# EAGLE design Rxxx (EAGLE 6.6.0)
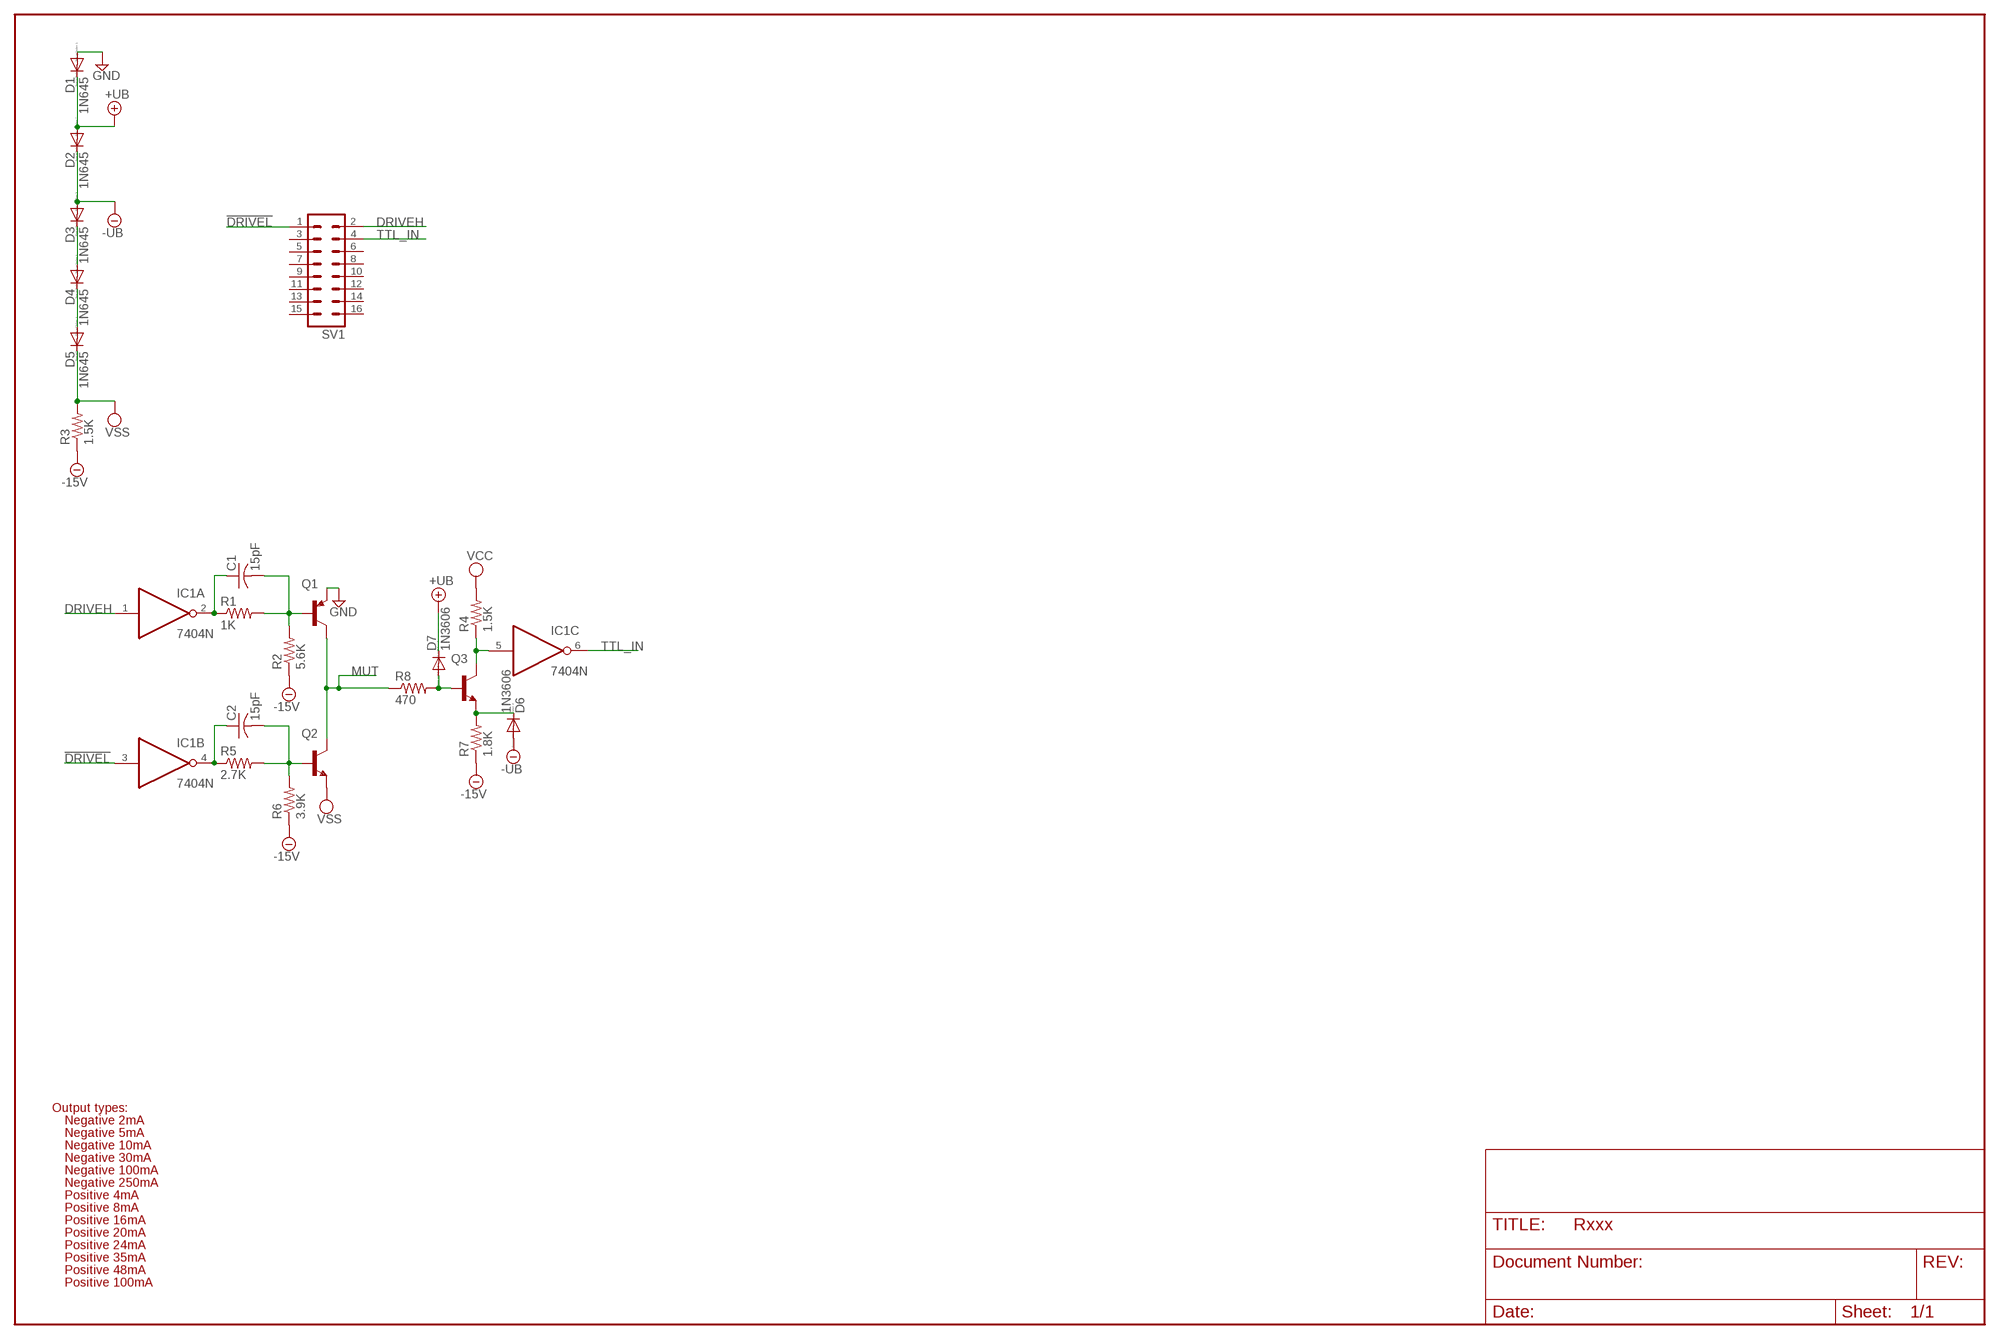
[diagram p0: schematic, sheet 1]

## Parts
C1  15pF  C-US050-025X075  [C050-025X075]
C2  15pF  C-US050-025X075  [C050-025X075]
D1  1N645  DIODE-DO35-10  [DO35-10]
D2  1N645  DIODE-DO35-10  [DO35-10]
D3  1N645  DIODE-DO35-10  [DO35-10]
D4  1N645  DIODE-DO35-10  [DO35-10]
D5  1N645  DIODE-DO35-10  [DO35-10]
D6  1N3606  DIODE-DO35-10  [DO35-10]
D7  1N3606  DIODE-DO35-10  [DO35-10]
IC1  7404N  [DIL14]
Q1  -PNP-TO5  [TO5]
Q2  -NPN-TO5  [TO5]
Q3  -NPN-TO5  [TO5]
R1  1K  R-US_0207/10  [0207/10]
R2  5.6K  R-US_0207/10  [0207/10]
R3  1.5K  R-US_0207/10  [0207/10]
R4  1.5K  R-US_0207/10  [0207/10]
R5  2.7K  R-US_0207/10  [0207/10]
R6  3.9K  R-US_0207/10  [0207/10]
R7  1.8K  R-US_0207/10  [0207/10]
R8  470  R-US_0207/10  [0207/10]
SV1  MA08-2  [MA08-2]

## Nets
!DRIVEL: IC1.3(B:I) SV1.1
+UB [supply]: D1.C D2.A D7.C
-15V [supply]: R2.1 R3.1 R6.1 R7.1
-UB [supply]: D2.C D3.A D6.A
DRIVEH: IC1.1(A:I) SV1.2
GND [supply]: D1.A Q1.1(E)
MUT: Q1.3(C) Q2.3(C) R8.1
N$1: C1.1 IC1.2(A:O) R1.1
N$2: C1.2 Q1.2(B) R1.2 R2.2
N$3: C2.1 IC1.4(B:O) R5.1
N$4: C2.2 Q2.2(B) R5.2 R6.2
N$7: IC1.5(C:I) Q3.3(C) R4.1
N$8: D3.C D4.A
N$9: D4.C D5.A
N$10: D6.C Q3.1(E) R7.2
N$11: D7.A Q3.2(B) R8.2
TTL_IN: IC1.6(C:O) SV1.4
VCC [supply]: R4.2
VSS [supply]: D5.C Q2.1(E) R3.2
Unconnected: IC1.8(D:O) IC1.9(D:I) IC1.10(E:O) IC1.11(E:I) IC1.12(F:O) IC1.13(F:I) SV1.3 SV1.5 SV1.6 SV1.7 SV1.8 SV1.9 SV1.10 SV1.11 SV1.12 SV1.13 SV1.14 SV1.15 SV1.16

## Notes on the sheet
- Output types:
- Negative 2mA
- Negative 5mA
- Negative 10mA
- Negative 30mA
- Negative 100mA
- Negative 250mA
- Positive 4mA
- Positive 8mA
- Positive 16mA
- Positive 20mA
- Positive 24mA
- Positive 35mA
- Positive 48mA
- Positive 100mA

## Power pins joined to a net without a drawn wire
GND: IC1.7(P:GND)
VCC: IC1.14(P:VCC)

## Library data of the parts
C1 C2 = rcl:C-US: CAPACITOR, American symbol
D1-D7 = diode:DIODE-: DIODE
IC1 = 74xx-us:74*04: Hex INVERTER
Q1 = transistor:*-PNP-: PNP Transistror
Q2 Q3 = transistor:*-NPN-: NPN Transistror BF959 corrected 2008.03.06
R1-R8 = rcl:R-US_: RESISTOR, American symbol
SV1 = con-lstb:MA08-2: PIN HEADER; OC_FARNELL: unknown; OC_NEWARK: unknown

## Net classes
1 supply: width 0.813 mm

## Board
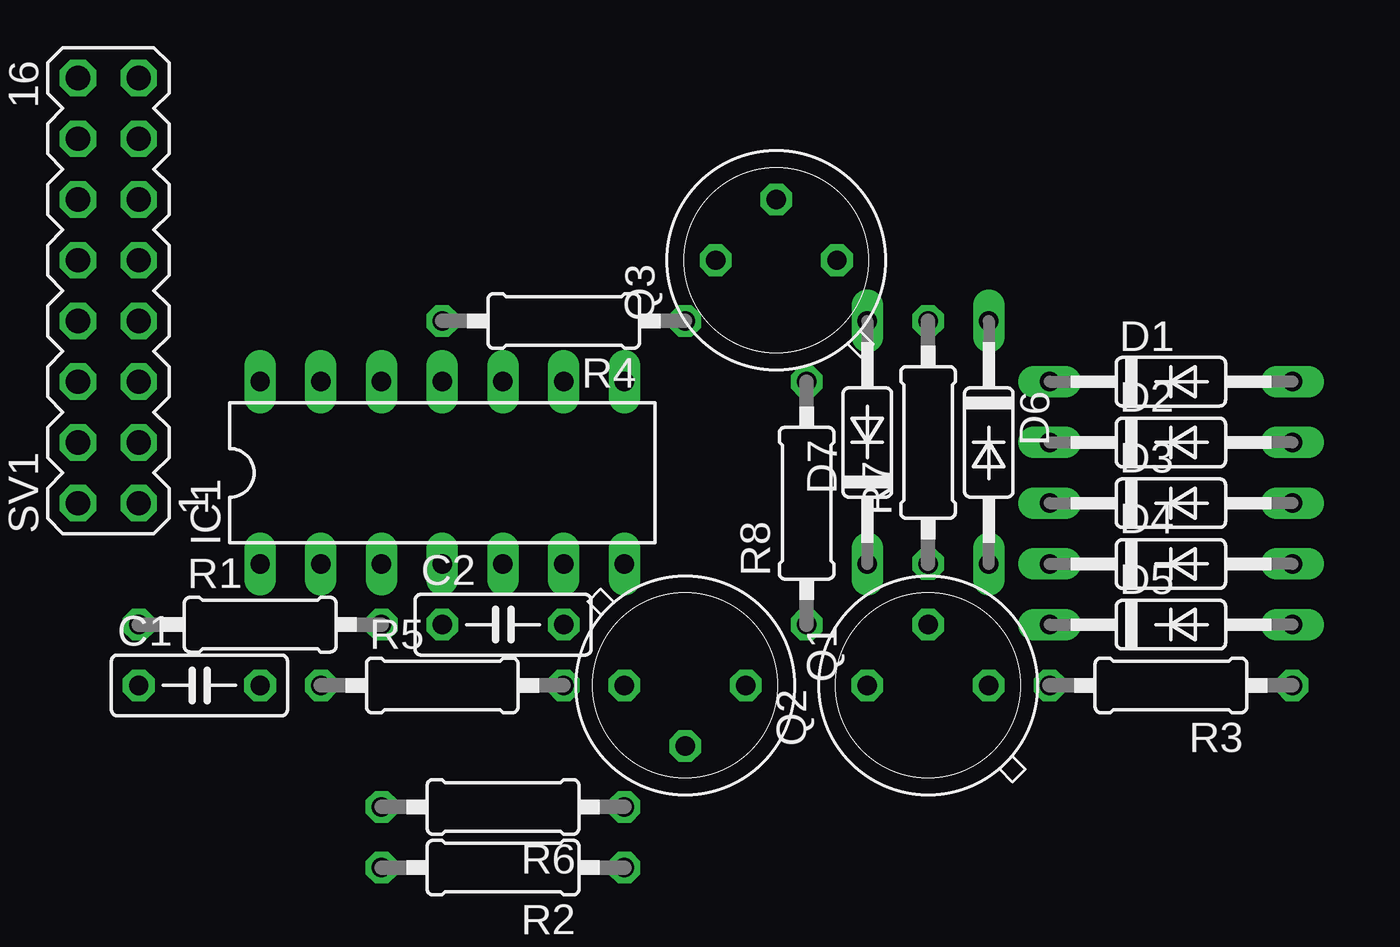
[diagram p1: board, top side]
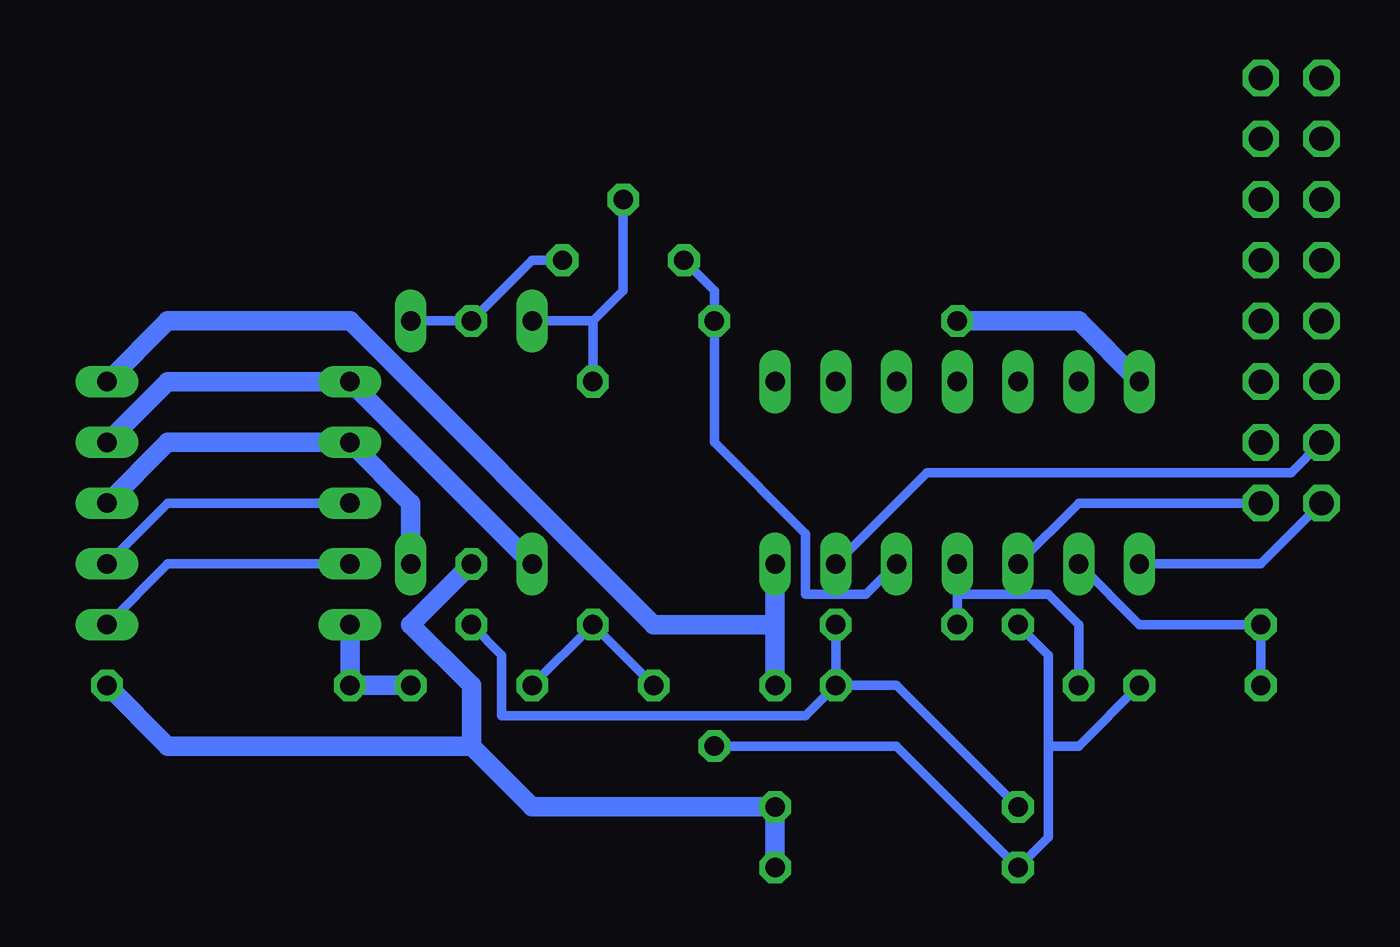
[diagram p2: board, bottom side, seen from below]

No outline drawn. Coordinates in mm, seen from the top.
Copper layers (1+16): Top 0.035mm / dielectric 1.5mm / Bottom 0.035mm
Design rules "16mils": minimum track width 16mil, minimum drill 32mil, track to track 15mil, track to pad 10mil, pad to pad 10mil, via to via 10mil, smd to smd 10mil, copper to edge 13mil, drill to drill 10mil, minimum pad ring 10mil, minimum via ring 8mil, stop-mask expansion 0mil, vias tented up to drill 0mil, thermal gap 10mil

### Footprints (pad centres in the part's own frame; a part is rotated, then mirrored left to right if it is on the bottom)
C050-025X075 = drill 0.813 octagon: 1 -2.54,0; 2 2.54,0
DO35-10 = drill 0.813 long: A 5.08,0; C -5.08,0
DIL14 = drill 0.813 long: 1 -7.62,-3.81; 2 -5.08,-3.81; 3 -2.54,-3.81; 4 0,-3.81; 5 2.54,-3.81; 6 5.08,-3.81; 7 7.62,-3.81; 8 7.62,3.81; 9 5.08,3.81; 10 2.54,3.81; 11 0,3.81; 12 -2.54,3.81; 13 -5.08,3.81; 14 -7.62,3.81
TO5 = drill 0.813 octagon: 1 0,-2.54; 2 2.54,0; 3 0,2.54
0207/10 = drill 0.813 octagon: 1 -5.08,0; 2 5.08,0
MA08-2 = drill 1.016 octagon: 1 -8.89,-1.27; 2 -8.89,1.27; 3 -6.35,-1.27; 4 -6.35,1.27; 5 -3.81,-1.27; 6 -3.81,1.27; 7 -1.27,-1.27; 8 -1.27,1.27; 9 1.27,-1.27; 10 1.27,1.27; 11 3.81,-1.27; 12 3.81,1.27; 13 6.35,-1.27; 14 6.35,1.27; 15 8.89,-1.27; 16 8.89,1.27

### Placement (x,y rotation side)
C1  10.16,12.7 0 top
C2  22.86,15.24 0 top
D1  50.8,25.4 0 top
D2  50.8,22.86 0 top
D3  50.8,20.32 0 top
D4  50.8,17.78 0 top
D5  50.8,15.24 0 top
D6  43.18,22.86 270 top
D7  38.1,22.86 90 top
IC1  20.32,21.59 0 top
Q1  30.48,12.7 270 top
Q2  40.64,12.7 90 top
Q3  34.29,30.48 90 top
R1  12.7,15.24 0 top
R2  22.86,5.08 180 top
R3  50.8,12.7 180 top
R4  25.4,27.94 180 top
R5  20.32,12.7 0 top
R6  22.86,7.62 180 top
R7  40.64,22.86 90 top
R8  35.56,20.32 90 top
SV1  6.35,29.21 90 top

### Tracks (layer width: path | path; a pad name or v marks a point on that pad's centre or on a via)
!DRIVEL
  Bottom 0.406: SV1.1 15.24,20.32 IC1.3
+UB
  Bottom 0.813: D2.A 53.34,25.4 D1.C D7.C
-15V
  Bottom 0.813: R6.1 R2.1 R6.1 | R3.1 53.34,10.16 40.64,10.16 | 40.64,10.16 40.64,12.7 43.18,15.24 R7.1 | R6.1 38.1,7.62 40.64,10.16
-UB
  Bottom 0.813: D3.A 53.34,22.86 D2.C 43.18,20.32 D6.A
DRIVEH
  Bottom 0.406: IC1.1 7.62,17.78 SV1.2
GND
  Bottom 0.813: 27.94,15.24 IC1.7 | D1.A 53.34,27.94 45.72,27.94 33.02,15.24 27.94,15.24 | Q1.1 27.94,15.24
MUT
  Bottom 0.406: Q1.3 R8.1 Q2.3
N$1
  Bottom 0.406: IC1.2 12.7,15.24 R1.1 C1.1
N$2
  Bottom 0.406: 16.51,10.16 16.51,6.35 R2.2 22.86,10.16 Q1.2 | 16.51,10.16 15.24,10.16 C1.2 | R1.2 16.51,13.97 16.51,10.16
N$3
  Bottom 0.406: R5.1 15.24,15.24 16.51,16.51 20.32,16.51 | 20.32,16.51 IC1.4 | 20.32,16.51 C2.1
N$4
  Bottom 0.406: R6.2 22.86,12.7 R5.2 | R5.2 C2.2 | Q2.2 39.37,13.97 39.37,11.43 26.67,11.43 R5.2
N$7
  Bottom 0.406: Q3.3 30.48,29.21 R4.1 30.48,22.86 26.67,19.05 26.67,16.51 24.13,16.51 IC1.5
N$8
  Bottom 0.406: D3.C 53.34,20.32 D4.A
N$9
  Bottom 0.406: D4.C 53.34,17.78 D5.A
N$10
  Bottom 0.406: Q3.1 38.1,30.48 R7.2 D6.C
N$11
  Bottom 0.406: Q3.2 34.29,29.21 35.56,27.94 | 35.56,27.94 D7.A | R8.2 35.56,27.94
TTL_IN
  Bottom 0.406: SV1.4 6.35,21.59 21.59,21.59 IC1.6
VCC
  Bottom 0.813: R4.2 15.24,27.94 IC1.14
VSS
  Bottom 0.813: Q2.1 R3.2 D5.C